# Altium schematic sheet MCUConfig.SchDoc
size A4; SheetNumber: 4; SheetTotal: 8
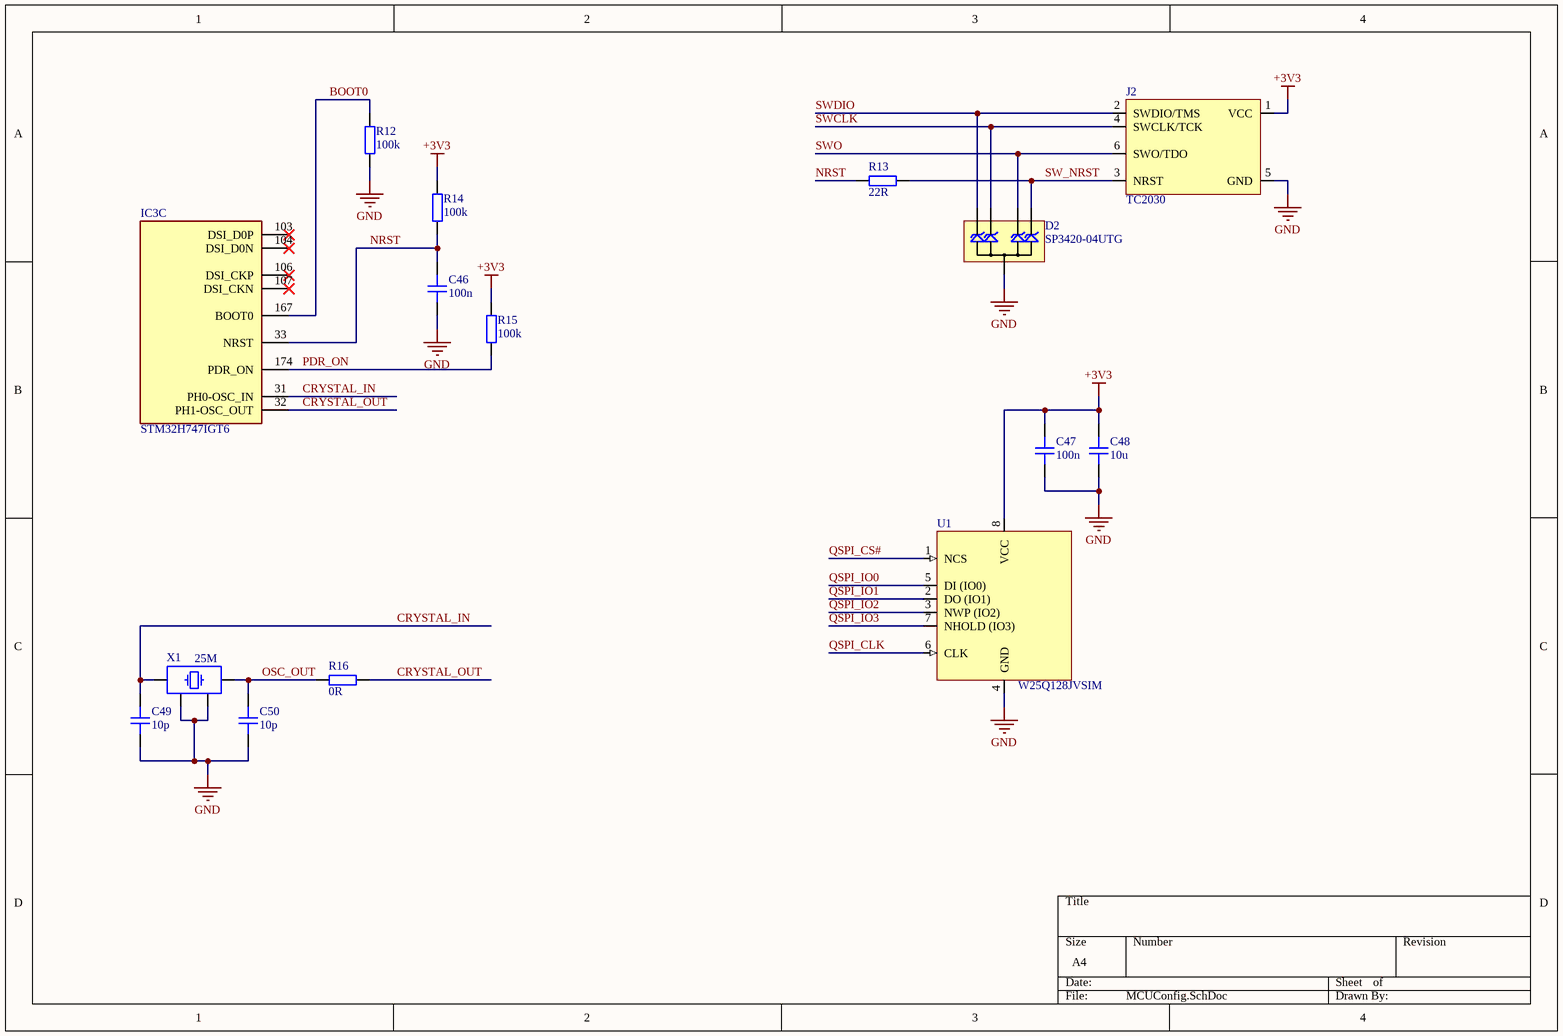
[diagram p0: MCUConfig.SchDoc]

## Parts
C46  100n  [CAP_0402]
C47  100n  [CAP_0402]
C48  10u  [CAP_0603]
C49  10p  [CAP_0402]
C50  10p  [CAP_0402]
D2  SP3420-04UTG  [uDFN-10]
IC3  STM32H747IGT6  [QFP50P2600X2600X160-176N]  (part C of 10)
J2  TC2030  [TC2030-FP]  (no BOM)
R12  100k  [RES_0402]
R13  22R  [RES_0402]
R14  100k  [RES_0402]
R15  100k  [RES_0402]
R16  0R  [RES_0402]
U1  W25Q128JVSIM  [SOIC-8]
X1  25M  [XTAL_3225]

## Nets
+3V3: C47.2 C48.2 J2.1(VCC) R14.2 R15.2 U1.8(VCC)
GND: C46.1 C47.1 C48.1 C49.1 C50.1 D2.38(GND) J2.5(GND) R12.1 U1.4(GND) X1.2 X1.4
BOOT0: IC3.167(BOOT0) R12.2
CRYSTAL_IN: C49.2 IC3.31(PH0-OSC_IN) X1.1
CRYSTAL_OUT: IC3.32(PH1-OSC_OUT) R16.2
NRST: C46.2 IC3.33(NRST) R13.2 R14.1
OSC_OUT: C50.2 R16.1 X1.3
PDR_ON: IC3.174(PDR_ON) R15.1
QSPI_CLK: U1.6(CLK)
QSPI_CS#: U1.1(NCS)
QSPI_IO0: U1.5(DI_(IO0))
QSPI_IO1: U1.2(DO_(IO1))
QSPI_IO2: U1.3(NWP_(IO2))
QSPI_IO3: U1.7(NHOLD_(IO3))
SW_NRST: D2.56 J2.3(NRST) R13.1
SWCLK: D2.29 J2.4(SWCLK/TCK)
SWDIO: D2.110 J2.2(SWDIO/TMS)
SWO: D2.47 J2.6(SWO/TDO)

Not connected (* = marked no-connect by the designer): IC3 103(DSI_D0P)* 104(DSI_D0N)* 106(DSI_CKP)* 107(DSI_CKN)*

## Library data of the parts
C46 C47 C49 C50 = CAP_0402: Capacitor SMD 0402; Manufacturer: *; Manufacturer Part Number: *; Distributor Link: *; LCSC: *; Rating: *; Dielectric: *
C48 = CAP_0603: Capacitor SMD 0603; Manufacturer: *; Manufacturer Part Number: *; Distributor Link: *; LCSC: *; Rating: *; Dielectric: *
D2 = SP3420-04UTG: TVS Diode Array Low Capacitance ESD Protection 4-Channel (Vwork=3V3, Vclamp=6V); Manufacturer: Littelfuse; Manufacturer Part Number: SP3420-04UTG
IC3 = STM32H747IGT6: Integrated Circuit; Manufacturer_Name: STMicroelectronics; Datasheet Link: https://www.mouser.com/datasheet/2/389/dm00602212-1799407.pdf; Height: 1.6mm; Manufacturer_Part_Number: STM32H747IGT6; Mouser Part Number: 511-STM32H747IGT6; Mouser Price/Stock: https://www.mouser.co.uk/ProductDetail/STMicroelectronics/STM32H747IGT6?qs=%252B6g0mu59x7Kw%252BsPEalqvLg%3D%3D; Arrow Part Number: STM32H747IGT6; Arrow Price/Stock: null?region=nac
J2 = TC2030: Tag-Connect No-Solder SWD Debug Connector DO NOT PLACE; Manufacturer: Tag-Connect; Manufacturer Part Number: TC2030
R12-R16 = RES_0402: Resistor SMD 0402; Manufacturer: *; Manufacturer Part Number: *; Distributor Link: *; LCSC: *
U1 = W25Q128JVSIM: 128M-BIT / SERIAL FLASH MEMORY WITH / DUAL/QUAD SPI & QPI & DTR SOIC-8; Manufacturer: Winbond; Manufacturer Part Number: W25Q128JVSIM
X1 = XTAL_3225: Crystal SMD 3225; Distributor Link: *